# Altium schematic sheet yinhaonanPower.SchDoc
size A4
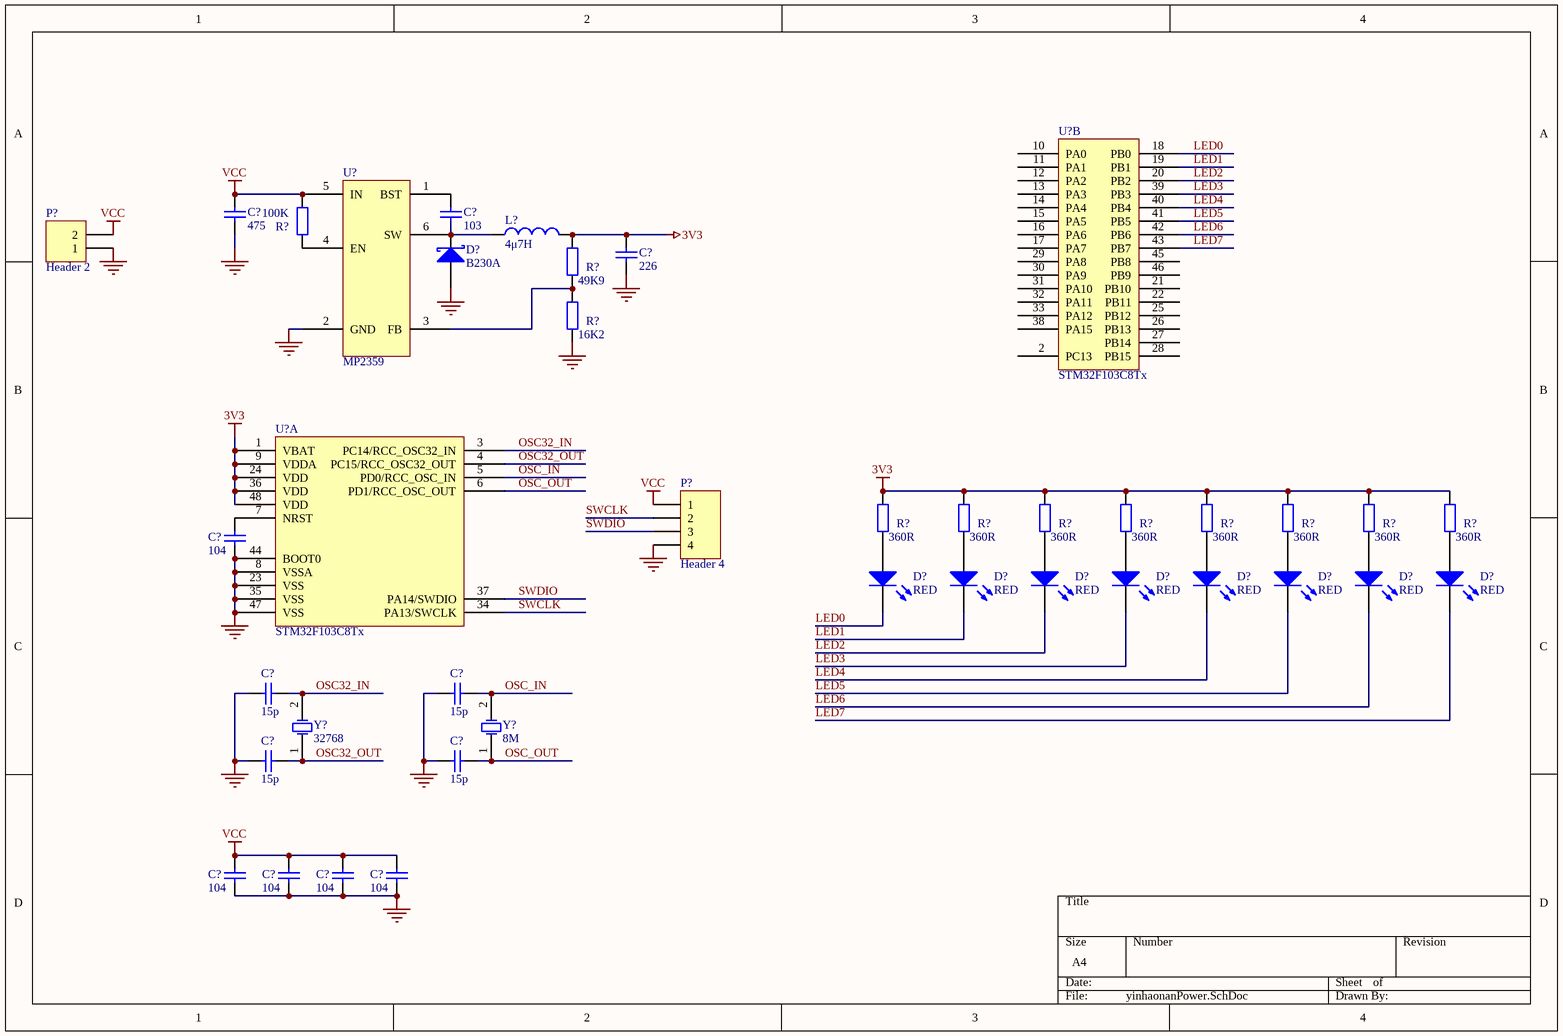
[diagram p0: yinhaonanPower.SchDoc]

## Parts
(Parts that share a designator on the sheet are numbered #1, #2 ... from top to bottom, then left to right.)
C?#1  475  [RAD-0.3]
C?#2  103  [RAD-0.3]
C?#3  226  [RAD-0.3]
C?#4  104  [RAD-0.3]
C?#5  15p  [RAD-0.3]
C?#6  15p  [RAD-0.3]
C?#7  15p  [RAD-0.3]
C?#8  15p  [RAD-0.3]
C?#9  104  [RAD-0.3]
C?#10  104  [RAD-0.3]
C?#11  104  [RAD-0.3]
C?#12  104  [RAD-0.3]
D?#1  B230A  [SOT-23_N]
D?#2  RED  [LED-0]
D?#3  RED  [LED-0]
D?#4  RED  [LED-0]
D?#5  RED  [LED-0]
D?#6  RED  [LED-0]
D?#7  RED  [LED-0]
D?#8  RED  [LED-0]
D?#9  RED  [LED-0]
L?  value 4μ7H  [0402-A]
P?#1  Header 2  [HDR1X2H]
P?#2  Header 4  [HDR1X4]
R?#1  value 100K  [AXIAL-0.4]
R?#2  value 49K9  [AXIAL-0.4]
R?#3  value 16K2  [AXIAL-0.4]
R?#4  value 360R  [AXIAL-0.4]
R?#5  value 360R  [AXIAL-0.4]
R?#6  value 360R  [AXIAL-0.4]
R?#7  value 360R  [AXIAL-0.4]
R?#8  value 360R  [AXIAL-0.4]
R?#9  value 360R  [AXIAL-0.4]
R?#10  value 360R  [AXIAL-0.4]
R?#11  value 360R  [AXIAL-0.4]
U?#1  STM32F103C8Tx  (part B of 2)
U?#2  MP2359
U?#3  STM32F103C8Tx  (part A of 2)
Y?#1  32768  [R38]
Y?#2  8M  [R38]

## Nets
3V3: C?#3.2 L?.2 R?#2.1 R?#4.1 R?#5.1 R?#6.1 R?#7.1 R?#8.1 R?#9.1 R?#10.1 R?#11.1 U?#3.1(VBAT) U?#3.9(VDDA) U?#3.24(VDD) U?#3.36(VDD) U?#3.48(VDD)
NetC?#1_1: C?#1.1 C?#3.1 C?#4.1 C?#5.2 C?#6.2 C?#7.2 C?#8.2 C?#9.1 C?#10.1 C?#11.1 C?#12.1 D?#1.1(A) P?#1.1 P?#2.4 R?#3.2 U?#2.2(GND) U?#3.8(VSSA) U?#3.23(VSS) U?#3.35(VSS) U?#3.44(BOOT0) U?#3.47(VSS)
VCC: C?#1.2 C?#9.2 C?#10.2 C?#11.2 C?#12.2 P?#1.2 P?#2.1 R?#1.1 U?#2.5(IN)
LED0: D?#2.2(K) U?#1.18(PB0)
LED1: D?#3.2(K) U?#1.19(PB1)
LED2: D?#4.2(K) U?#1.20(PB2)
LED3: D?#5.2(K) U?#1.39(PB3)
LED4: D?#6.2(K) U?#1.40(PB4)
LED5: D?#7.2(K) U?#1.41(PB5)
LED6: D?#8.2(K) U?#1.42(PB6)
LED7: D?#9.2(K) U?#1.43(PB7)
OSC32_IN: C?#5.1 U?#3.3(PC14/RCC_OSC32_IN) Y?#1.2(OSC2)
OSC32_OUT: C?#7.1 U?#3.4(PC15/RCC_OSC32_OUT) Y?#1.1(OSC1)
OSC_IN: C?#6.1 U?#3.5(PD0/RCC_OSC_IN) Y?#2.2(OSC2)
OSC_OUT: C?#8.1 U?#3.6(PD1/RCC_OSC_OUT) Y?#2.1(OSC1)
SWCLK: P?#2.2 U?#3.34(PA13/SWCLK)
SWDIO: P?#2.3 U?#3.37(PA14/SWDIO)
NetC?#2_1: C?#2.1 D?#1.3(K) L?.1 U?#2.6(SW)
NetC?#2_2: C?#2.2 U?#2.1(BST)
NetC?#4_2: C?#4.2 U?#3.7(NRST)
NetD?#2_1: D?#2.1(A) R?#4.2
NetD?#3_1: D?#3.1(A) R?#5.2
NetD?#4_1: D?#4.1(A) R?#6.2
NetD?#5_1: D?#5.1(A) R?#7.2
NetD?#6_1: D?#6.1(A) R?#8.2
NetD?#7_1: D?#7.1(A) R?#9.2
NetD?#8_1: D?#8.1(A) R?#10.2
NetD?#9_1: D?#9.1(A) R?#11.2
NetR?#1_2: R?#1.2 U?#2.4(EN)
NetR?#2_2: R?#2.2 R?#3.1 U?#2.3(FB)

Not connected (* = marked no-connect by the designer): U?#1 2(PC13) 10(PA0) 11(PA1) 12(PA2) 13(PA3) 14(PA4) 15(PA5) 16(PA6) 17(PA7) 21(PB10) 22(PB11) 25(PB12) 26(PB13) 27(PB14) 28(PB15) 29(PA8) 30(PA9) 31(PA10) 32(PA11) 33(PA12) 38(PA15) 45(PB8) 46(PB9)

## Library data of the parts
C?#1-C?#12 = Cap: Capacitor; Published: 8-Jun-2000; LatestRevisionDate: 17-Jul-2002; LatestRevisionNote: Re-released for DXP Platform.; PackageReference: RAD-0.3; Publisher: Altium Limited; PackageDescription: Radial Cap, Thru-Hole; 2 Leads; 0.3 in Pin Spacing
D?#1 = Diode BAS70: Silicon AF Schottky Diode for High-Speed Switching; Note: Pin 2 is not connected and not drawn.; Published: 21-Mar-2003; LatestRevisionDate: 29-May-2009; LatestRevisionNote: IPC-7351 Footprint Added.; DatasheetVersion: Oct-1999; PackageVersion: Sep-2001; PackageReference: SOT-23; Publisher: Altium Limited; PackageDescription: 3-Pin SOT-23 Package 0.95 mm Pitch, 2.5 mm Lead Span; ComponentLink1Description: Manufacturer Link; ComponentLink1URL: http://www.infineon.com/; ComponentLink2Description: Datasheet; ComponentLink2URL: http://www.infineon.com/upload/Document/cmc_upload/documents/009/382/bas40_bas140series_1.pdf
D?#2-D?#9 = LED0: Typical INFRARED GaAs LED; Published: 8-Jun-2000; LatestRevisionDate: 08-Jul-2005; LatestRevisionNote: Mech Layer 1 removed.; PackageReference: LED-0; Publisher: Altium Limited; PackageDescription: LED; 2 Leads
L? = Inductor: Code_IEC: 1005; Published: 8-Jun-2000; LatestRevisionDate: 29-May-2009; LatestRevisionNote: IPC-7351 Footprint Added.; PackageReference: 0402-A; Publisher: Altium Limited; PackageDescription: Chip Inductor; Code_JEITA: 0402
P?#1 = Header 2H: Header, 2-Pin, Right Angle; LatestRevisionDate: 17-Jul-2002; LatestRevisionNote: Re-released for DXP Platform.; Publisher: Altium Limited
P?#2 = Header 4: Header, 4-Pin; LatestRevisionDate: 17-Jul-2002; LatestRevisionNote: Re-released for DXP Platform.; Publisher: Altium Limited
R?#1-R?#11 = Res2: Resistor; Published: 8-Jun-2000; LatestRevisionDate: 17-Jul-2002; LatestRevisionNote: Re-released for DXP Platform.; PackageReference: AXIAL-0.4; Publisher: Altium Limited; PackageDescription: Axial Device, Thru-Hole; 2 Leads; 0.4 in Pin Spacing
Y?#1 Y?#2 = XTAL: Crystal Oscillator; Published: 8-Jun-2000; LatestRevisionDate: 17-Jul-2002; LatestRevisionNote: Re-released for DXP Platform.; PackageReference: R38; Publisher: Altium Limited; PackageDescription: Crystal, Thru-Hole; 2 Leads; Body 3.1 x 8.2 mm (Dia.xH)